# EAGLE board board2 (EAGLE 6.6.0), part 1 of 2
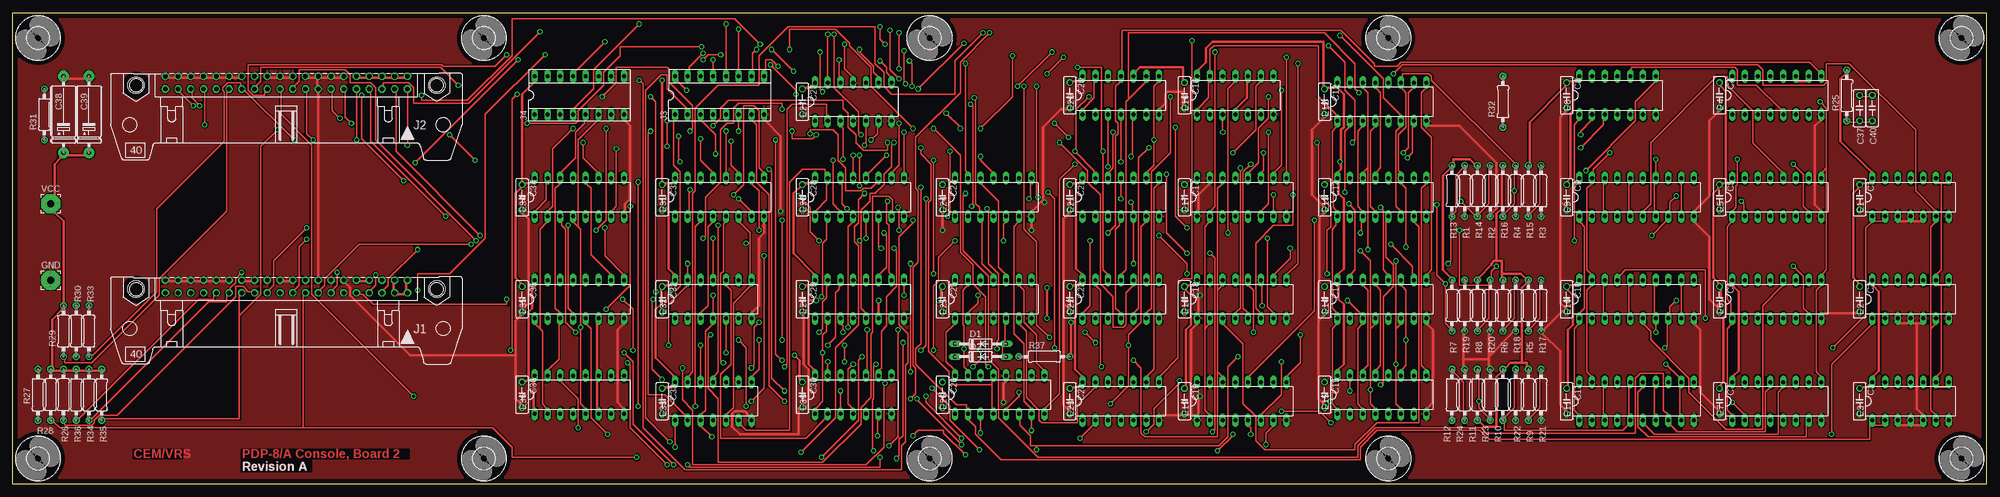
[diagram p4: board, top side]
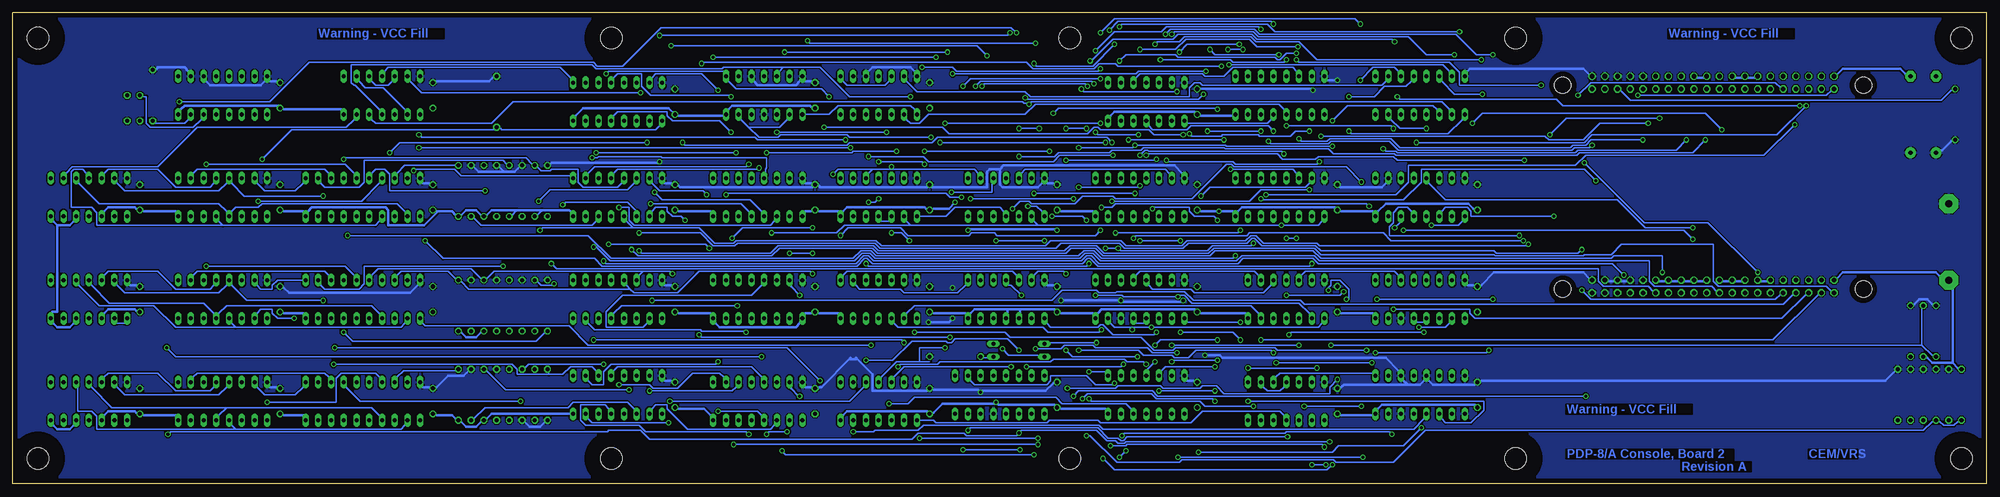
[diagram p5: board, bottom side, seen from below]

Size 393.7 x 93.98 mm. Coordinates in mm from the lower left corner, seen from the top.
Outline: 0,0 0,93.98 393.7,93.98 393.7,0 0,0
Copper layers (1*16): Top 0.035mm / dielectric 1.5mm / Bottom 0.035mm
Design rules "olimex8mil": minimum track width 10mil, minimum drill 24mil, track to track 8mil, track to pad 8mil, pad to pad 10mil, via to via 8mil, smd to smd 8mil, copper to edge 40mil, drill to drill 10mil, minimum pad ring 10mil, minimum via ring 8mil, stop-mask expansion 0mil, vias tented up to drill 0mil, thermal gap 10mil
Net classes: 1 Supply: width 0.508 mm

## Footprints (pad centres in the part's own frame; a part is rotated, then mirrored left to right if it is on the bottom)
C050-025X075 = drill 0.813 octagon: 1 -2.54,0; 2 2.54,0
E15-5 = drill 0.813 pad 2.159: + -7.62,0 | drill 0.813 pad 2.159 octagon: - 7.62,0
DO35-10 = drill 0.813 long: A 5.08,0; C -5.08,0
DIL14 = drill 0.813 long: 1 -7.62,-3.81; 2 -5.08,-3.81; 3 -2.54,-3.81; 4 0,-3.81; 5 2.54,-3.81; 6 5.08,-3.81; 7 7.62,-3.81; 8 7.62,3.81; 9 5.08,3.81; 10 2.54,3.81; 11 0,3.81; 12 -2.54,3.81; 13 -5.08,3.81; 14 -7.62,3.81
DIL16 = drill 0.813 long: 1 -8.89,-3.81; 2 -6.35,-3.81; 3 -3.81,-3.81; 4 -1.27,-3.81; 5 1.27,-3.81; 6 3.81,-3.81; 7 6.35,-3.81; 8 8.89,-3.81; 9 8.89,3.81; 10 6.35,3.81; 11 3.81,3.81; 12 1.27,3.81; 13 -1.27,3.81; 14 -3.81,3.81; 15 -6.35,3.81; 16 -8.89,3.81
DIL20 = drill 0.813 long: 1 -11.43,-3.81; 2 -8.89,-3.81; 3 -6.35,-3.81; 4 -3.81,-3.81; 5 -1.27,-3.81; 6 1.27,-3.81; 7 3.81,-3.81; 8 6.35,-3.81; 9 8.89,-3.81; 10 11.43,-3.81; 11 11.43,3.81; 12 8.89,3.81; 13 6.35,3.81; 14 3.81,3.81; 15 1.27,3.81; 16 -1.27,3.81; 17 -3.81,3.81; 18 -6.35,3.81; 19 -8.89,3.81; 20 -11.43,3.81
3,81/1,4 = drill 1.397 pad 3.81 octagon: 1 0,0
40H = drill 0.914: 1 -24.13,-1.27 | drill 0.914 octagon: 2 -24.13,1.27; 3 -21.59,-1.27; 4 -21.59,1.27; 5 -19.05,-1.27; 6 -19.05,1.27; 7 -16.51,-1.27; 8 -16.51,1.27; 9 -13.97,-1.27; 10 -13.97,1.27; 11 -11.43,-1.27; 12 -11.43,1.27; 13 -8.89,-1.27; 14 -8.89,1.27; 15 -6.35,-1.27; 16 -6.35,1.27; 17 -3.81,-1.27; 18 -3.81,1.27; 19 -1.27,-1.27; 20 -1.27,1.27; 21 1.27,-1.27; 22 1.27,1.27; 23 3.81,-1.27; 24 3.81,1.27; 25 6.35,-1.27; 26 6.35,1.27; 27 8.89,-1.27; 28 8.89,1.27; 29 11.43,-1.27; 30 11.43,1.27; 31 13.97,-1.27; 32 13.97,1.27; 33 16.51,-1.27; 34 16.51,1.27; 35 19.05,-1.27; 36 19.05,1.27; 37 21.59,-1.27; 38 21.59,1.27; 39 24.13,-1.27; 40 24.13,1.27 | hole 3.302: -29.972,0.533; 29.972,0.533
SOCKET-16 = drill 0.813 long: 1 -8.89,-3.81; 2 -6.35,-3.81; 3 -3.81,-3.81; 4 -1.27,-3.81; 5 1.27,-3.81; 6 3.81,-3.81; 7 6.35,-3.81; 8 8.89,-3.81; 9 8.89,3.81; 10 6.35,3.81; 11 3.81,3.81; 12 1.27,3.81; 13 -1.27,3.81; 14 -3.81,3.81; 15 -6.35,3.81; 16 -8.89,3.81
0207/10 = drill 0.813 octagon: 1 -5.08,0; 2 5.08,0
4,3 = hole 4.3: 0,0

## Placement (x,y rotation side)
C1  [C050-025X075]  368.3,57.15 270 top
C2  [C050-025X075]  368.3,36.83 270 top
C3  [C050-025X075]  368.3,16.51 270 top
C4  [C050-025X075]  340.36,77.47 270 top
C5  [C050-025X075]  340.36,57.15 270 top
C6  [C050-025X075]  340.36,36.83 270 top
C7  [C050-025X075]  340.36,16.51 270 top
C8  [C050-025X075]  309.88,77.47 270 top
C9  [C050-025X075]  309.88,57.15 270 top
C10  [C050-025X075]  309.88,36.83 270 top
C11  [C050-025X075]  309.88,16.51 270 top
C12  [C050-025X075]  261.62,76.2 270 top
C13  [C050-025X075]  261.62,57.15 270 top
C14  [C050-025X075]  261.62,36.83 270 top
C15  [C050-025X075]  261.62,17.78 270 top
C16  [C050-025X075]  233.68,77.47 270 top
C17  [C050-025X075]  233.68,57.15 270 top
C18  [C050-025X075]  233.68,36.83 270 top
C19  [C050-025X075]  233.68,16.51 270 top
C20  [C050-025X075]  210.82,77.47 270 top
C21  [C050-025X075]  210.82,57.15 270 top
C22  [C050-025X075]  210.82,36.83 270 top
C23  [C050-025X075]  210.82,16.51 270 top
C24  [C050-025X075]  185.42,57.15 270 top
C25  [C050-025X075]  185.42,36.83 270 top
C26  [C050-025X075]  185.42,17.78 270 top
C27  [C050-025X075]  157.48,76.2 270 top
C28  [C050-025X075]  157.48,57.15 270 top
C29  [C050-025X075]  157.48,36.83 270 top
C30  [C050-025X075]  157.48,17.78 270 top
C31  [C050-025X075]  129.54,57.15 270 top
C32  [C050-025X075]  129.54,36.83 270 top
C33  [C050-025X075]  129.54,16.51 270 top
C34  [C050-025X075]  101.6,57.15 270 top
C35  [C050-025X075]  101.6,36.83 270 top
C36  [C050-025X075]  101.6,17.78 270 top
C37  10  [C050-025X075]  368.3,74.93 90 top
C38  6.8uF  [E15-5]  10.16,73.66 90 top
C39  6.8uF  [E15-5]  15.24,73.66 90 top
C40  47  [C050-025X075]  370.84,74.93 90 top
D1  D664  [DO35-10]  193.04,27.94 0 top
D2  D664  [DO35-10]  193.04,25.4 0 top
E1  74LS95N  [DIL14]  378.46,57.15 0 top
E2  74LS95N  [DIL14]  378.46,36.83 0 top
E3  74LS95N  [DIL14]  378.46,16.51 0 top
E4  74LS123N  [DIL16]  351.79,77.47 0 top
E5  74LS175N  [DIL16]  351.79,57.15 0 top
E6  74LS175N  [DIL16]  351.79,36.83 0 top
E7  74LS175N  [DIL16]  351.79,16.51 0 top
E8  74LS00N  [DIL14]  320.04,77.47 0 top
E9  74S244N  [DIL20]  323.85,57.15 0 top
E10  74S244N  [DIL20]  323.85,36.83 0 top
E11  74S244N  [DIL20]  323.85,16.51 0 top
E12  74LS174N  [DIL16]  273.05,76.2 0 top
E13  74LS174N  [DIL16]  273.05,57.15 0 top
E14  74LS174N  [DIL16]  273.05,36.83 0 top
E15  74LS174N  [DIL16]  273.05,17.78 0 top
E16  74LS74N  [DIL14]  243.84,77.47 0 top
E17  74LS153N  [DIL16]  245.11,57.15 0 top
E18  74LS153N  [DIL16]  245.11,36.83 0 top
E19  74LS153N  [DIL16]  245.11,16.51 0 top
E20  74LS74N  [DIL14]  220.98,77.47 0 top
E21  74LS27N  [DIL14]  220.98,57.15 0 top
E22  74LS02N  [DIL14]  220.98,36.83 0 top
E23  7416N  [DIL14]  220.98,16.51 0 top
E24  74LS04N  [DIL14]  195.58,57.15 0 top
E25  74LS27N  [DIL14]  195.58,36.83 0 top
E26  74LS75N  [DIL16]  196.85,17.78 0 top
E27  7404N  [DIL14]  167.64,76.2 0 top
E28  74LS367N  [DIL16]  168.91,57.15 0 top
E29  74LS138N  [DIL16]  168.91,36.83 0 top
E30  74LS00N  [DIL14]  167.64,17.78 0 top
E31  74LS367N  [DIL16]  140.97,57.15 0 top
E32  74LS08N  [DIL14]  139.7,36.83 0 top
E33  74LS02N  [DIL14]  139.7,16.51 0 top
E34  74LS367N  [DIL16]  113.03,57.15 0 top
E35  74LS138N  [DIL16]  113.03,36.83 0 top
E36  74LS174N  [DIL16]  113.03,17.78 0 top
GND  [3,81/1,4]  7.62,40.64 0 top
J1  [40H]  54.61,39.37 180 top
J2  [40H]  54.61,80.01 180 top
J3  [SOCKET-16]  140.97,77.47 0 top
J4  [SOCKET-16]  113.03,77.47 0 top
R1  680  [0207/10]  289.56,58.42 90 top
R2  680  [0207/10]  294.64,58.42 90 top
R3  680  [0207/10]  304.8,58.42 90 top
R4  680  [0207/10]  299.72,58.42 90 top
R5  330  [0207/10]  302.26,35.56 90 top
R6  330  [0207/10]  297.18,35.56 90 top
R7  330  [0207/10]  287.02,35.56 90 top
R8  330  [0207/10]  292.1,35.56 90 top
R9  330  [0207/10]  302.26,17.78 90 top
R10  330  [0207/10]  297.18,17.78 90 top
R11  330  [0207/10]  292.1,17.78 270 top
R12  330  [0207/10]  287.02,17.78 270 top
R13  330  [0207/10]  287.02,58.42 90 top
R14  330  [0207/10]  292.1,58.42 90 top
R15  330  [0207/10]  302.26,58.42 90 top
R16  330  [0207/10]  297.18,58.42 90 top
R17  680  [0207/10]  304.8,35.56 90 top
R18  680  [0207/10]  299.72,35.56 90 top
R19  680  [0207/10]  289.56,35.56 90 top
R20  680  [0207/10]  294.64,35.56 90 top
R21  680  [0207/10]  304.8,17.78 90 top
R22  680  [0207/10]  299.72,17.78 90 top
R23  680  [0207/10]  294.64,17.78 270 top
R24  680  [0207/10]  289.56,17.78 270 top
R25  6K8  [0207/10]  365.76,77.47 270 top
R26  180  [0207/10]  10.16,17.78 90 top
R27  390  [0207/10]  5.08,17.78 270 top
R28  1K  [0207/10]  7.62,17.78 90 top
R29  180  [0207/10]  10.16,30.48 90 top
R30  390  [0207/10]  12.7,30.48 90 top
R31  1K  [0207/10]  6.35,73.66 270 top
R32  1K  [0207/10]  297.18,76.2 90 top
R33  1K  [0207/10]  15.24,30.48 90 top
R34  1K  [0207/10]  15.24,17.78 270 top
R35  1K  [0207/10]  17.78,17.78 270 top
R36  1K  [0207/10]  12.7,17.78 270 top
R37  10K  [0207/10]  205.74,25.4 0 top
U$11  [4,3]  93.98,88.9 0 top
U$12  [4,3]  5.08,88.9 0 top
U$13  [4,3]  182.88,88.9 0 top
U$14  [4,3]  274.32,88.9 0 top
U$15  [4,3]  388.62,88.9 0 top
U$16  [4,3]  388.62,5.08 0 top
U$17  [4,3]  274.32,5.08 0 top
U$18  [4,3]  182.88,5.08 0 top
U$19  [4,3]  93.98,5.08 0 top
U$20  [4,3]  5.08,5.08 0 top
VCC  [3,81/1,4]  7.62,55.88 0 top

## Tracks (layer width: path | path; a pad name or v marks a point on that pad's centre or on a via)
!ADRLTH
  Top 0.254: E14.9 282.19,41.91 282.96,42.67 282.96,69.09 280.92,71.12 280.92,77.98 281.69,78.74 E12.9
  Bottom 0.254: E8.11 319.53,82.3 318.77,83.06 284.48,83.06 282.45,81.03 E12.9
!BFSW  (via drill 0.61)
  Top 0.254: v169.16,69.6 168.66,70.1 168.66,74.17 163.83,78.99 v163.83,89.66 | v98.55,85.6 96.27,83.31 85.85,83.31 85.6,83.57 46.99,83.57 46.99,78.49 48.01,77.47 50.29,77.47 50.29,78.49 J2.24 | v177.8,70.1 E28.9
  Bottom 0.254: v177.8,70.1 177.29,69.6 v169.16,69.6 | v163.83,89.66 162.81,90.68 146.05,90.68 145.03,89.66 105.92,89.66 101.85,85.6 v98.55,85.6
!BKDTACNTL  (via drill 0.61)
  Top 0.254: v163.58,64.52 163.58,55.88 164.85,54.61 E28.3 | v133.1,64.26 132.84,64.52 v132.84,69.34 | v67.56,71.88 66.29,73.15 66.29,78.23 J2.12
  Bottom 0.254: v163.58,64.52 163.32,64.26 150.37,64.26 149.86,63.75 133.6,63.75 v133.1,64.26 | v132.84,69.34 88.14,69.34 87.38,68.58 80.52,68.58 77.22,71.88 v67.56,71.88
!BOOTF  (via drill 0.61)
  Top 0.254: v176.78,71.88 176.78,63.5 175.51,62.23 E28.10 | v210.57,69.09 v207.77,71.88
  Bottom 0.254: v207.77,71.88 v176.78,71.88 | v210.57,69.09 226.82,69.09 227.33,69.6 240.54,69.6 241.05,69.09 244.86,69.09 246.89,71.12 | 246.89,71.12 248.41,72.64 E16.6 | 246.89,71.12 240.79,71.12 239.27,72.64 E16.2
!BUSEN  (via drill 0.61)
  Top 0.254: v58.67,51.05 52.07,44.45 52.07,39.62 51.05,38.61 J1.24
  Bottom 0.254: v58.67,51.05 68.07,51.05 73.66,56.64 107.95,56.64 111.25,59.94 E34.13
!DEP  (via drill 0.61)
  Top 0.254: v92.46,48.51 72.39,68.58 72.39,78.99 71.37,80.01 67.31,80.01 67.31,81.53 66.29,82.55 57.15,82.55 57.15,80.26 56.13,79.25 J2.20 | v170.18,49.02 E28.5
  Bottom 0.254: v170.18,49.02 169.67,49.53 147.57,49.53 147.07,50.04 120.4,50.04 118.87,48.51 v92.46,48.51
!DSPLTH  (via drill 0.61)
  Top 0.254: E15.9 281.69,22.86 280.92,23.62 280.92,58.93 281.69,59.69 E13.9 | v313.69,62.48 323.6,72.39 323.6,76.2 327.41,80.01 E8.8
  Bottom 0.254: v313.69,62.48 313.44,62.74 305.56,62.74 304.29,61.47 282.45,61.47 E13.9
!EMA0  (via drill 0.61)
  Top 0.254: R34.2 15.75,12.95 39.12,36.32 42.67,36.32 42.67,37.85 J1.30 43.43,38.61 43.43,39.12 44.45,40.13 44.45,40.89 v45.72,42.16 | v165.86,87.63 165.86,82.8 167.39,81.28 E27.11 | v80.26,64.01 v100.84,84.58
  Bottom 0.254: v165.86,87.63 165.35,88.14 161.04,88.14 160.02,89.15 146.81,89.15 145.8,88.14 137.16,88.14 133.6,84.58 v100.84,84.58 | v80.26,64.01 68.33,52.07 55.63,52.07 v45.72,42.16
!EMA1  (via drill 0.61)
  Top 0.254: 45.21,33.53 45.21,37.85 J1.28 | 45.21,33.53 45.21,12.95 18.29,12.95 R35.2 | v168.91,86.61 168.91,86.11 171.7,83.31 171.7,82.04 172.47,81.28 E27.9 | v137.41,87.12 121.16,87.12 121.16,85.34 117.86,82.04 117.86,79.5 112.78,74.42 112.78,72.39 112.27,71.88 v102.62,71.88 | v52.83,70.61 49.53,67.31 49.53,37.85 45.21,33.53
  Bottom 0.254: v168.91,86.61 161.8,86.61 159.77,88.65 147.07,88.65 145.54,87.12 v137.41,87.12 | v102.62,71.88 100.58,73.91 56.13,73.91 v52.83,70.61
!EMA2  (via drill 0.61)
  Top 0.254: R36.2 13.21,12.95 37.08,36.83 40.13,36.83 40.13,37.85 J1.32 | v106.17,85.6 94.23,73.66 94.23,49.02 87.12,41.91 80.77,41.91 v80.77,38.61 | v162.56,89.66 E27.13
  Bottom 0.254: v162.56,89.66 162.05,90.17 146.3,90.17 145.29,89.15 115.32,89.15 111.76,85.6 v106.17,85.6 | v80.77,38.61 78.99,36.83 42.16,36.83 41.15,37.85 J1.32
!EMODE  (via drill 0.61)
  Top 0.254: 382.52,30.99 382.52,14.73 383.29,13.97 E3.6 | 382.52,30.99 383.29,31.75 E2.6 | 382.52,30.99 382.52,51.31 383.29,52.07 E1.6 383.29,54.61 379.48,58.42 379.48,70.61 366.27,83.82 361.7,83.82 361.7,80.01 361.19,79.5 349,79.5 349,82.55 347.98,83.57 277.11,83.57 v275.34,81.79 | v230.89,77.22 230.89,66.04 227.08,62.23 227.08,35.05 226.31,34.29 E22.6
  Bottom 0.254: v230.89,77.22 232.41,78.74 249.43,78.74 250.95,80.26 E16.8 251.97,82.3 274.83,82.3 v275.34,81.79
!FUN  (via drill 0.61)
  Top 0.254: v192.53,37.59 192.53,36.07 190.75,34.29 E25.2 | v151.13,83.57 156.21,78.49 v156.21,77.72 | v191.77,76.96 192.02,76.71 192.02,55.88 192.79,55.12 192.79,54.61 E24.3 193.29,52.07 193.29,43.94 195.33,41.91 E25.11
  Bottom 0.254: v192.53,37.59 194.56,39.62 195.07,39.62 E25.11 | v151.13,83.57 108.46,83.57 107.19,82.3 J4.15 | v156.21,77.72 157.23,76.71 191.52,76.71 v191.77,76.96
!GATEENT  (via drill 0.61)
  Top 0.254: E11.1 312.17,13.97 311.4,14.73 311.4,30.99 312.17,31.75 E10.1 312.67,34.29 313.44,35.05 313.44,51.31 312.67,52.07 E9.1 | v218.95,16 222.5,19.56 v222.5,27.69 222.5,29.72 225.04,32.26 225.04,51.31 225.81,52.07 E21.6
  Bottom 0.254: v218.95,16 215.14,16 213.87,17.27 185.67,17.27 184.4,16 171.7,16 170.69,14.99 E30.5 | v222.5,27.69 278.89,27.69 282.7,31.5 311.4,31.5 311.91,32 E10.1
!GATESR  (via drill 0.61)
  Top 0.254: E11.19 314.71,21.59 313.94,22.35 313.94,38.61 314.71,39.37 E10.19 314.71,41.91 313.94,42.67 313.94,58.93 314.71,59.69 E9.19 315.21,62.23 315.21,62.74 v318.52,66.04 | v137.67,49.02 138.18,49.53 138.18,57.15 141.22,60.2 141.22,70.61 142.49,71.88 143.76,71.88 143.76,74.93 144.78,75.95 153.42,75.95 v153.42,74.68 | v186.18,73.91 188.98,71.12 v188.98,70.87 | v193.04,70.87 199.39,77.22 v199.39,85.34 | v262.38,87.38 265.68,84.07 265.68,78.49 267.72,76.45 267.72,68.58 v267.21,68.07 | v139.7,49.02 E32.11
  Bottom 0.254: v137.67,49.02 v139.7,49.02 | v153.42,74.68 153.67,74.93 185.17,74.93 v186.18,73.91 | v188.98,70.87 v193.04,70.87 | v199.39,85.34 201.42,87.38 v262.38,87.38 | v267.21,68.07 316.48,68.07 v318.52,66.04
!IND1  (via drill 0.61)
  Top 0.254: v86.36,53.34 71.37,68.33 71.37,78.23 J2.8 | v139.19,29.72 138.68,29.21 138.68,19.05 140.72,17.02 140.72,4.32 161.54,4.32 169.16,11.94 169.16,15.24 171.2,17.27 171.2,29.97 171.45,30.23 171.45,57.4 174.75,57.4 175.51,56.64 175.51,54.61 E28.7 | v112.27,30.23 110.24,32.26 110.24,50.8 109.47,51.56 109.47,52.07 E34.3
  Bottom 0.254: v86.36,53.34 102.87,53.34 102.87,54.36 103.63,55.12 107.95,55.12 108.71,54.36 E34.3 | v139.19,29.72 138.68,30.23 v112.27,30.23
!IND2  (via drill 0.61)
  Top 0.254: v93.22,49.53 76.45,66.29 76.45,78.23 J2.4
  Bottom 0.254: v93.22,49.53 119.13,49.53 119.13,51.31 118.36,52.07 118.36,54.1 117.35,55.12 115.57,55.12 114.81,54.36 E34.5
!INIT  (via drill 0.61)
  Top 0.254: v143.76,57.66 145.8,59.69 145.8,75.44 147.83,75.44 148.84,74.42 148.84,62.99 149.61,62.23 E31.9 | v38.35,71.63 38.35,78.23 J2.34
  Bottom 0.254: v143.76,57.66 117.86,57.66 115.32,60.2 115.32,63.5 82.04,63.5 80.01,65.53 44.45,65.53 v38.35,71.63
!KEY-F  (via drill 0.61)
  Top 0.254: 195.33,19.81 195.33,20.32 E26.13 | 195.33,19.81 195.33,15.24 E26.4 | v130.56,72.39 v130.56,67.31 | v169.93,67.56 170.18,67.82 E27.5 | 195.33,19.81 186.69,19.81 186.69,22.35 182.63,26.42 182.63,56.13 183.13,56.64 183.13,63.75 181.1,65.79 v181.1,67.06
  Bottom 0.254: v130.56,72.39 127.51,75.44 110.49,75.44 109.73,74.68 J4.3 | v130.56,67.31 151.64,67.31 151.89,67.56 v169.93,67.56 170.43,67.06 v181.1,67.06
!KEYCNTL  (via drill 0.61)
  Top 0.254: v137.16,68.83 137.16,64.52 139.45,62.23 E31.13 | v68.58,68.58 J2.10
  Bottom 0.254: v137.16,68.83 136.65,68.33 131.57,68.33 131.06,68.83 118.87,68.83 117.09,67.06 83.06,67.06 82.55,67.56 80.01,67.56 78.99,68.58 v68.58,68.58
!KEYSTB  (via drill 0.61)
  Top 0.254: v242.32,50.04 242.32,78.74 243.59,80.01 E16.11 | v140.72,51.56 140.72,22.35 139.95,21.59 E33.11
  Bottom 0.254: E33.11 140.21,19.3 140.97,18.54 143.51,18.54 144.27,19.3 E33.9 | 189.23,51.56 v140.72,51.56 133.35,51.56 132.59,52.32 E31.1 | 189.23,51.56 189.99,52.32 E24.2 | 214.63,51.56 215.39,52.32 E21.2 | 214.63,51.56 189.23,51.56 | v242.32,50.04 229.36,50.04 227.84,51.56 214.63,51.56
!KFUN0  (via drill 0.61)
  Top 0.254: E3.2 372.87,11.68 371.35,11.68 E3.1 370.33,11.68 370.33,8.89 294.39,8.89 292.61,10.67 272.03,10.67 268.73,7.37 268.73,4.83 197.1,4.83 192.02,9.91 192.02,11.43 190.75,12.7 E26.2 190.25,15.24 190.25,15.75 188.21,15.75 180.09,23.88 180.09,26.92 181.1,27.94 v181.1,59.18 | v140.21,65.79 140.21,69.6 137.41,72.39 J3.3 | v168.91,59.44 v168.91,65.53
  Bottom 0.254: v140.21,65.79 140.72,66.29 167.13,66.29 167.39,66.55 167.89,66.55 v168.91,65.53 | v168.91,59.44 169.16,59.18 v181.1,59.18
!KFUN1  (via drill 0.61)
  Top 0.254: v131.06,8.38 126.24,13.21 126.24,78.49 129.29,81.53 130.56,81.53 130.56,78.74 134.37,74.93 J3.2 | v193.04,10.16 E26.3 | v362.71,9.91 362.71,23.88 370.59,31.75 E2.1
  Bottom 0.254: E2.1 371.35,32 372.87,32 E2.2 | v131.06,8.38 171.7,8.38 171.96,8.13 173.23,8.13 173.74,8.64 175.51,8.64 177.55,10.67 192.53,10.67 v193.04,10.16 193.55,9.65 203.45,9.65 203.96,10.16 213.11,10.16 214.38,8.89 266.7,8.89 268.48,10.67 274.83,10.67 275.08,10.41 362.2,10.41 v362.71,9.91
!KFUN2  (via drill 0.61)
  Top 0.254: E1.2 372.87,52.32 371.35,52.32 E1.1 370.59,52.07 369.57,51.05 369.57,33.78 v362.97,27.18 | v244.35,25.4 242.32,23.37 242.32,9.4 240.54,7.62 204.22,7.62 | 204.22,7.62 202.95,7.62 202.95,9.65 200.91,11.68 200.91,12.7 E26.6 | v131.32,38.61 132.33,38.61 133.1,39.37 133.1,62.23 131.83,63.5 131.83,72.39 J3.1 | v127.76,36.83 127.51,36.58 127.51,22.86 v129.54,20.83 | v183.39,19.05 186.94,15.49 186.94,12.7 v192.79,6.86 | 204.22,7.62 v204.22,6.86
  Bottom 0.254: v362.97,27.18 361.19,25.4 v244.35,25.4 | v131.32,38.61 131.32,39.12 130.81,39.62 130.81,40.64 129.03,40.64 127.25,38.86 127.25,36.83 v127.76,36.83 | v129.54,20.83 131.06,19.3 131.06,18.03 152.15,18.03 153.67,19.56 156.46,19.56 156.97,19.05 164.34,19.05 164.85,19.56 173.23,19.56 173.74,19.05 v183.39,19.05 | v204.22,6.86 v192.79,6.86
!LAENAB  (via drill 0.61)
  Top 0.254: v212.85,9.14 215.39,11.68 E23.2 | v189.23,9.14 182.12,16.26 v182.12,17.53 | v80.01,17.53 59.69,37.85 59.69,67.56 53.59,73.66 53.59,78.23 J2.22
  Bottom 0.254: v189.23,9.14 v212.85,9.14 | v182.12,17.53 181.1,18.54 166.37,18.54 165.35,17.53 v80.01,17.53
!MAEN  (via drill 0.61)
  Top 0.254: v235.2,88.39 235.2,40.89 233.43,40.89 232.41,39.88 232.41,25.15 228.85,21.59 E23.8 | v180.59,78.74 v189.74,87.88 | v161.54,78.23 161.04,78.74 v161.04,86.11 | v149.1,87.63 144.02,92.71 99.57,92.71 99.57,85.34 90.68,76.45 81.53,76.45 v81.53,77.47
  Bottom 0.254: v235.2,88.39 234.7,87.88 v189.74,87.88 | v180.59,78.74 180.09,78.23 v161.54,78.23 | v161.04,86.11 159.51,87.63 v149.1,87.63 | v81.53,77.47 78.99,80.01 42.16,80.01 41.15,78.99 J2.32
!MALC  (via drill 0.61)
  Top 0.254: v159,69.85 159,70.61 163.58,70.61 164.59,69.6 164.59,64.52 166.12,62.99 166.12,58.42 169.16,58.42 169.67,58.93 171.2,58.93 172.21,59.94 E28.11 | v135.13,70.36 135.64,70.87 135.64,75.44 131.06,80.01 131.06,82.55 130.56,83.06 120.4,83.06 120.4,80.01 v117.6,77.22 | v37.34,75.44 35.81,76.96 35.81,78.23 J2.36
  Bottom 0.254: v159,69.85 158.5,69.34 152.65,69.34 152.4,69.6 145.29,69.6 145.03,69.34 138.94,69.34 137.92,70.36 v135.13,70.36 | v117.6,77.22 117.09,76.71 85.85,76.71 84.58,75.44 v37.34,75.44
!MCLOCK  (via drill 0.61)
  Top 0.254: v127.25,70.36 126.75,69.85 126.75,17.78 130.05,17.78 134.11,13.72 E33.2
  Bottom 0.254: v127.25,70.36 126.75,69.85 107.44,69.85 104.65,72.64 J4.1
!MD  (via drill 0.61)
  Top 0.254: v120.4,66.8 120.4,55.37 119.63,54.61 E34.7 | v59.94,68.58 58.67,69.85 58.67,78.23 J2.18
  Bottom 0.254: v120.4,66.8 119.89,66.29 117.86,66.29 117.6,66.04 82.04,66.04 81.53,66.55 61.98,66.55 v59.94,68.58
!MEMSTART  (via drill 0.61)
  Top 0.254: v194.56,23.37 194.06,23.88 194.06,37.34 191.52,39.88 191.52,43.69 188.98,46.23 188.98,65.53 v183.64,70.87 | v179.58,70.87 171.2,79.25 171.2,83.06 166.88,87.38 166.88,87.88 164.08,90.68 154.94,90.68 v154.94,86.61 | v141.22,85.6 138.68,85.6 v137.67,84.58 | v88.9,79.5 85.34,83.06 49.53,83.06 49.53,80.26 48.51,79.25 J2.26
  Bottom 0.254: v194.56,23.37 215.9,23.37 217.93,21.34 E23.12 | v179.58,70.87 v183.64,70.87 | v154.94,86.61 153.92,85.6 v141.22,85.6 | v137.67,84.58 137.16,84.07 107.19,84.07 105.16,82.04 105.16,79.5 v88.9,79.5
!MH0  (via drill 0.61)
  Top 0.254: E21.9 226.31,62.23 227.58,63.5 v227.58,68.58 227.58,79.25 228.35,80.01 E20.8 | v312.67,69.6 312.67,70.36 314.71,72.39 E8.2
  Bottom 0.254: E8.2 315.47,74.68 319.79,78.99 323.34,78.99 324.61,80.26 E8.9 | E20.12 218.95,80.26 219.71,79.5 227.33,79.5 228.09,80.26 E20.8 | v312.67,69.6 312.17,69.09 245.62,69.09 245.11,68.58 v227.58,68.58
!MSIRDIS  (via drill 0.61)
  Top 0.254: v143.26,68.33 143.26,63.5 144.53,62.23 E31.11 | v78.74,67.56 J2.2
  Bottom 0.254: v143.26,68.33 142.75,67.82 131.32,67.82 130.81,68.33 119.13,68.33 117.35,66.55 82.8,66.55 82.3,67.06 79.25,67.06 v78.74,67.56
!PANLOCK  (via drill 0.61)
  Top 0.254: v189.99,83.82 189.99,62.48 190.25,62.23 E24.13 | v173.99,87.63 172.97,88.65 v172.97,91.19 | v105.16,90.17 90.93,75.95 80.01,75.95 80.01,78.99 78.99,80.01 73.91,80.01 73.91,79.25 J2.6
  Bottom 0.254: v189.99,83.82 189.48,83.31 178.31,83.31 v173.99,87.63 | v172.97,91.19 172.47,91.69 143.51,91.69 141.99,90.17 v105.16,90.17 | R31.1 7.11,78.49 9.14,76.45 71.12,76.45 73.15,78.49 J2.6
!PULSELOADADD  (via drill 0.61)
  Top 0.254: v144.78,56.9 147.07,54.61 E31.7 | v77.98,60.45 69.6,68.83 v69.6,77.47
  Bottom 0.254: v144.78,56.9 144.53,56.64 116.33,56.64 112.78,60.2 112.78,62.74 80.26,62.74 v77.98,60.45 | v69.6,77.47 32,77.47 30.99,78.49 J2.40
!RUN  (via drill 0.61)
  Top 0.254: 57.91,11.18 9.4,11.18 8.13,12.45 R28.1 | 57.91,11.18 57.91,37.85 J1.18 | v197.61,48.51 197.61,51.82 197.87,52.07 E24.5 | v187.96,48.51 184.66,45.21 184.66,40.39 183.64,39.37 v183.64,26.67 | v169.42,25.4 168.66,24.64 168.66,12.7 v161.29,5.33 | v124.46,5.33 99.57,5.33 99.57,7.37 95.76,11.18 57.91,11.18
  Bottom 0.254: v187.96,48.51 v197.61,48.51 | v183.64,26.67 182.37,25.4 v169.42,25.4 | v124.46,5.33 v161.29,5.33
!SHLT
  Bottom 0.254: J3.5 142.75,72.64 143.51,71.88 159.51,71.88 E27.1
!SINGSTEP  (via drill 0.61)
  Top 0.254: v87.12,69.6 v92.2,64.52 | v65.28,72.9 63.75,74.42 63.75,78.23 J2.14 | v167.64,65.53 E28.13
  Bottom 0.254: v167.64,65.53 167.39,65.79 141.48,65.79 140.46,64.77 133.86,64.77 133.35,65.28 118.36,65.28 117.6,64.52 v92.2,64.52 | v87.12,69.6 83.82,72.9 v65.28,72.9
!SRDATA  (via drill 0.61)
  Top 0.254: v130.81,27.69 130.81,35.81 134.37,39.37 E32.13 v134.62,43.94 | v311.4,48.51 311.4,71.63 312.17,72.39 E8.1 | J2.30 42.93,78.23 42.67,77.98 42.67,54.36 29.21,40.89 29.21,37.59 15.75,24.13 10.41,24.13 10.41,24.64 R29.1
  Bottom 0.254: v130.81,27.69 12.95,27.69 | 12.95,27.69 10.92,25.65 R29.1 | v311.4,48.51 307.85,44.96 277.62,44.96 276.1,43.43 225.3,43.43 223.77,44.96 223.27,44.96 222.25,43.94 180.34,43.94 179.32,44.96 178.82,44.96 177.29,43.43 135.13,43.43 v134.62,43.94 | 12.95,27.69 12.95,34.8 R30.2
!STATE  (via drill 0.61)
  Top 0.254: v113.79,68.07 113.79,65.02 116.59,62.23 E34.11 | v36.07,75.44 33.27,78.23 J2.38
  Bottom 0.254: v113.79,68.07 80.26,68.07 78.74,69.6 41.91,69.6 v36.07,75.44
!STHIS
  Bottom 0.254: J3.4 140.21,74.68 141.22,75.69 189.74,75.69 191.77,73.66 211.07,73.66 212.85,71.88 214.63,71.88 215.39,72.64 E20.2
!TS1  (via drill 0.61)
  Top 0.254: v218.44,63.25 E20.3 | J1.26 47.75,38.35 46.99,38.35 45.97,39.37 44.45,39.37 44.45,37.34 20.83,13.72 17.27,13.72 16.26,12.7 16.26,12.19 15.75,11.68 10.41,11.68 10.41,11.94 R26.1 | v179.58,9.65 180.59,10.67 185.67,10.67 185.67,10.16 v189.99,5.84 | v240.28,6.6 243.33,9.65 v243.33,9.91 | v239.27,10.41 239.78,10.92 239.78,44.96 v238.76,45.97 | v234.19,45.97 230.12,50.04 v230.12,61.72
  Bottom 0.254: 218.44,62.74 222.25,62.74 | 218.44,62.74 201.93,62.74 201.17,61.98 E24.9 | 222.25,62.74 223.01,61.98 E21.10 | 218.44,62.74 v218.44,63.25 | R27.2 5.84,12.45 6.6,11.68 8.64,11.68 9.4,12.45 R26.1 10.92,12.45 12.7,10.67 112.01,10.67 118.36,4.32 129.79,4.32 130.3,4.83 160.53,4.83 161.04,4.32 173.48,4.32 178.82,9.65 v179.58,9.65 | v189.99,5.84 239.52,5.84 v240.28,6.6 | v243.33,9.91 242.82,10.41 v239.27,10.41 | v234.19,45.97 v238.76,45.97 | v230.12,61.72 229.11,62.74 222.25,62.74
ADDR0  (via drill 0.61)
  Top 0.254: v256.29,83.82 256.29,43.94 254.25,41.91 E18.9 | v152.65,83.31 151.38,84.58 150.11,84.58 150.11,82.55 J3.9
  Bottom 0.254: v256.29,83.82 256.03,84.07 191.52,84.07 190.25,82.8 178.05,82.8 177.04,83.82 173.74,83.82 173.23,83.31 v152.65,83.31
ADDR1  (via drill 0.61)
  Top 0.254: v204.47,57.15 204.22,57.4 v204.22,79.25 | v176.78,80.77 175.01,82.55 v175.01,90.42 | v251.46,57.66 E17.7 | v142.24,91.69 J3.12
  Bottom 0.254: v251.46,57.66 251.21,57.91 207.52,57.91 206.76,57.15 v204.47,57.15 | v204.22,79.25 202.69,80.77 v176.78,80.77 | v175.01,90.42 173.23,92.2 142.75,92.2 v142.24,91.69
ADDR2  (via drill 0.61)
  Top 0.254: v206.25,81.79 v209.55,85.09 | v155.7,82.3 v151.38,86.61 | v148.34,86.61 147.57,85.85 147.57,82.55 J3.10 | v254,85.09 E17.9
  Bottom 0.254: v209.55,85.09 v254,85.09 | v206.25,81.79 169.67,81.79 169.16,82.3 v155.7,82.3 | v151.38,86.61 v148.34,86.61
BEMA0
  Bottom 0.254: E27.10 169.67,81.03 168.91,81.79 156.46,81.79 155.96,81.28 152.15,81.28 150.37,83.06 138.43,83.06 137.67,82.3 J3.14
BEMA1  (via drill 0.61)
  Top 0.254: v172.97,84.33 174.24,83.06 174.24,82.04 175.01,81.28 E27.8 | v137.67,85.85 134.87,83.06 134.87,82.55 J3.15
  Bottom 0.254: v172.97,84.33 171.7,85.6 161.8,85.6 161.29,85.09 141.99,85.09 141.48,84.58 140.97,84.58 139.7,85.85 v137.67,85.85
BEMA2  (via drill 0.61)
  Top 0.254: v164.85,84.58 164.85,81.28 E27.12 | J3.13 v139.7,84.58
  Bottom 0.254: v139.7,84.58 140.21,84.07 150.37,84.07 150.88,84.58 v164.85,84.58
BPOK  (via drill 0.61)
  Top 0.254: E16.1 236.47,74.93 238.51,76.96 238.51,80.01 E16.13 238.76,86.61 239.52,87.38 260.35,87.38 260.35,77.22 263.91,73.66 E12.1 263.91,71.12 263.14,70.36 263.14,59.69 263.4,59.44 263.4,55.12 263.91,54.61 E13.1 263.91,52.07 263.91,51.56 263.14,50.8 263.14,35.05 263.91,34.29 E14.1 263.91,31.75 263.14,30.99 263.14,16.51 | E20.1 213.61,74.93 215.65,76.96 215.65,80.01 E20.13 | 263.14,16.51 263.14,16 263.91,15.24 E15.1 | 263.14,16.51 v262.64,16.51 | E7.1 342.65,13.97 341.88,14.73 341.88,30.99 342.65,31.75 E6.1 342.65,34.29 342.65,36.07 341.88,36.83 341.88,51.31 342.65,52.07 E5.1 343.15,54.61 343.66,55.12 343.66,59.44 343.92,59.69 v343.92,64.77
  Bottom 0.254: J4.10 119.89,80.26 120.65,79.5 156.46,79.5 156.97,80.01 157.99,80.01 159,78.99 159,77.22 190.75,77.22 191.77,78.23 213.36,78.23 215.39,80.26 E20.13 | E16.1 230.89,73.66 229.11,75.44 214.63,75.44 213.87,74.68 E20.1 | v262.64,16.51 226.82,16.51 224.03,19.3 E23.10 | E12.1 264.67,71.37 265.43,70.61 296.16,70.61 296.42,70.87 R32.1 297.69,70.61 338.07,70.61 v343.92,64.77
BRUN  (via drill 0.61)
  Top 0.254: E24.6 200.41,52.07 199.64,51.31 199.64,29.97 201.68,27.94 201.68,16.51 202.95,15.24 E26.7 v203.2,10.67 | v127.25,77.22 128.27,76.2 v128.27,38.35 | v139.7,37.59 E32.4 139.45,31.75 138.18,30.48 138.18,14.73 137.41,13.97 E33.3 137.41,11.43 v139.45,9.4
  Bottom 0.254: v127.25,77.22 122.17,77.22 120.14,79.25 115.82,79.25 114.81,80.26 J4.12 | v128.27,38.35 129.03,37.59 v139.7,37.59 | v203.2,10.67 202.69,11.18 177.29,11.18 175.26,9.14 173.23,9.14 172.72,8.64 172.21,8.64 171.45,9.4 v139.45,9.4
BUS0  (via drill 0.61)
  Top 0.254: E11.3 317.25,13.97 317.25,19.05 E11.18 | R9.1 302.51,13.21 304.55,15.24 304.55,22.35 R21.2 | E15.3 268.99,15.24 268.22,16 268.22,30.99 268.99,31.75 E14.3 268.73,34.04 v266.19,36.58
  Bottom 0.254: E11.18 316.99,21.34 315.72,22.61 305.31,22.61 R21.2 | v266.19,36.58 186.44,36.58 184.4,38.61 177.55,38.61 177.04,38.1 173.74,38.1 173.48,38.35 160.02,38.35 158.24,36.58 136.91,36.58 136.14,35.81 40.64,35.81 38.61,37.85 J1.34 | R9.1 301.75,12.95 299.47,15.24 282.96,15.24 281.94,16.26 271.02,16.26 269.75,14.99 E15.3
BUS1  (via drill 0.61)
  Top 0.254: E10.3 317.25,34.29 317.25,39.37 E10.18 | R5.1 302.51,30.99 304.55,33.02 304.55,40.13 R17.2 | E15.13 272.03,22.86 272.8,23.62 272.8,38.61 272.03,39.37 E14.13 | v118.36,34.8 123.19,39.62 v123.19,55.37 | v176.53,55.12 176.78,54.86 v176.78,50.55 | v228.6,49.53 234.19,43.94 v234.19,41.91
  Bottom 0.254: E10.18 316.99,41.66 316.23,42.42 306.83,42.42 305.31,40.89 R17.2 304.29,40.39 302.77,38.86 270.51,38.86 | v118.36,34.8 103.12,34.8 103.12,34.04 102.11,33.02 40.89,33.02 36.07,37.85 J1.36 | v123.19,55.37 123.7,55.88 173.74,55.88 174.5,55.12 v176.53,55.12 | v176.78,50.55 177.8,49.53 197.36,49.53 197.87,50.04 202.44,50.04 202.95,49.53 215.14,49.53 216.66,51.05 227.08,51.05 v228.6,49.53 | v234.19,41.91 234.7,42.42 256.79,42.42 261.11,38.1 269.75,38.1 270.51,38.86 | 270.51,38.86 271.27,39.62 E14.13
BUS2  (via drill 0.61)
  Top 0.254: E9.3 317.25,54.61 317.25,59.69 E9.18 | R15.1 302.51,53.85 304.55,55.88 304.55,62.99 R3.2 | E13.6 276.61,54.61 275.84,55.37 275.84,70.36 276.61,71.12 E12.6 276.61,73.66 273.3,76.96 273.3,80.77 v264.67,89.41 | v144.78,28.7 146.3,27.18 v146.3,15.49 | v179.07,17.02 180.09,18.03 180.09,23.11 179.58,23.62 179.58,43.18 180.59,44.2 180.59,58.42 180.09,58.93 180.09,69.09 188.98,77.98 188.98,84.07 v194.82,89.92
  Bottom 0.254: E9.18 316.99,61.98 315.47,63.5 R3.2 | v144.78,28.7 42.67,28.7 33.53,37.85 J1.38 | v146.3,15.49 155.96,15.49 156.97,16.51 178.56,16.51 v179.07,17.02 | v194.82,89.92 195.33,89.41 v264.67,89.41 | R15.1 301.75,53.09 300.23,51.56 278.13,51.56 277.37,52.32 E13.6
BUS3  (via drill 0.61)
  Top 0.254: E11.16 322.33,19.05 322.33,13.97 E11.5 322.07,11.68 321.06,10.67 297.43,10.67 297.43,12.19 R10.1 297.43,13.21 299.47,15.24 299.47,22.35 R22.2 | 270.76,30.99 v270.76,18.8 270.76,16 271.53,15.24 E15.4 | 270.76,30.99 271.53,31.75 E14.4 | v268.73,46.48 270.76,44.45 270.76,30.99
  Bottom 0.254: v268.73,46.48 268.22,45.97 242.57,45.97 241.05,47.5 222,47.5 220.98,46.48 183.9,46.48 182.88,47.5 177.55,47.5 176.02,45.97 155.19,45.97 154.18,46.99 134.11,46.99 132.84,45.72 98.3,45.72 98.04,45.47 80.52,45.47 80.26,45.72 74.93,45.72 72.9,47.75 54.61,47.75 54.61,40.39 53.59,39.37 32,39.37 30.99,38.35 J1.40 | v270.76,18.8 295.4,18.8 299.21,22.61 R22.2
BUS4  (via drill 0.61)
  Top 0.254: E10.5 322.33,34.29 322.33,39.37 E10.16 | R6.1 297.43,30.99 299.47,33.02 299.47,40.13 R18.2 | E15.14 269.49,22.86 270.26,23.62 270.26,38.61 269.49,39.37 E14.14 | v58.67,48.77 57.15,47.24 57.15,39.62 56.13,38.61 J1.20 | v116.33,50.55 118.36,52.58 v118.36,70.87 | v139.7,71.37 141.22,72.9 141.22,74.93 142.75,76.45 165.61,76.45 165.61,74.93 166.62,73.91 166.62,71.12 168.15,69.6 168.15,68.07 169.67,66.55 174.5,66.55 v174.5,68.07 | v260.1,68.07 260.35,67.82 260.35,57.66 262.89,55.12 262.89,51.31 262.13,50.55 v262.13,41.91
  Bottom 0.254: E10.16 322.07,41.66 320.8,42.93 302.26,42.93 300.23,40.89 R18.2 299.21,40.89 297.69,42.42 267.97,42.42 | v58.67,48.77 60.45,50.55 v116.33,50.55 | v118.36,70.87 118.87,71.37 v139.7,71.37 | v174.5,68.07 175.51,69.09 209.3,69.09 210.31,68.07 226.82,68.07 227.33,67.56 259.59,67.56 v260.1,68.07 | v262.13,41.91 262.64,42.42 267.97,42.42 | 267.97,42.42 268.73,41.66 E14.14
BUS5  (via drill 0.61)
  Top 0.254: E9.5 322.33,54.61 322.33,59.69 E9.16 | R16.1 297.43,53.85 299.47,55.88 v299.47,58.42 299.47,62.99 R4.2 299.47,64.01 282.96,80.52 282.96,81.28 282.45,81.79 277.11,81.79 277.11,81.28 E12.11 277.11,78.74 277.88,77.98 277.88,71.12 276.35,69.6 276.35,62.48 276.61,62.23 E13.11 277.11,59.69 277.88,58.93 v277.88,47.24
  Bottom 0.254: v299.47,58.42 318.52,58.42 318.52,61.72 319.53,62.74 321.31,62.74 322.07,61.98 E9.16 | v277.88,47.24 277.37,47.24 274.57,44.45 225.81,44.45 224.28,45.97 222.76,45.97 221.74,44.96 180.85,44.96 179.83,45.97 178.31,45.97 176.78,44.45 149.61,44.45 148.59,45.47 134.11,45.47 133.1,44.45 67.31,44.45 67.31,40.39 66.29,39.37 54.86,39.37 53.85,38.35 J1.22
BUS6  (via drill 0.61)
  Top 0.254: E11.7 327.41,13.97 327.41,19.05 E11.14 | R23.2 294.39,13.21 292.35,15.24 v292.35,16.51 292.35,22.35 R11.1 | 275.84,30.99 v275.84,23.88 275.84,16 276.61,15.24 E15.6 | 275.84,30.99 276.61,31.75 E14.6 | v72.39,41.66 72.39,39.62 71.37,38.61 J1.8 | v275.84,44.45 275.84,30.99
  Bottom 0.254: v292.35,16.51 324.36,16.51 327.15,19.3 E11.14 | v72.39,41.66 74.68,43.94 133.35,43.94 134.37,44.96 148.34,44.96 149.35,43.94 177.04,43.94 178.56,45.47 179.58,45.47 180.59,44.45 222,44.45 223.01,45.47 224.03,45.47 225.55,43.94 275.34,43.94 v275.84,44.45 | v275.84,23.88 290.83,23.88 291.59,23.11 R11.1
BUS7  (via drill 0.61)
  Top 0.254: E10.14 327.41,39.37 327.41,34.29 E10.7 v327.66,30.23 | R7.1 286.77,30.99 285.75,32 v285.75,39.88 283.97,41.66 v283.97,55.63 | E12.3 268.99,71.12 268.22,70.36 268.22,55.37 268.99,54.61 E13.3 268.99,52.07 268.99,50.29 v268.73,50.04 | v80.77,46.74 74.93,40.89 74.93,39.62 73.91,38.61 J1.6
  Bottom 0.254: v285.75,39.88 286,39.62 288.29,39.62 289.05,40.39 R19.2 | v327.66,30.23 325.88,28.45 289.31,28.45 287.53,30.23 R7.1 | v80.77,46.74 81.53,45.97 97.79,45.97 98.3,46.48 132.84,46.48 133.86,47.5 144.53,47.5 146.05,49.02 146.56,49.02 147.57,48.01 159.26,48.01 160.27,46.99 171.96,46.99 172.97,48.01 184.66,48.01 185.67,46.99 220.73,46.99 221.74,48.01 249.17,48.01 249.68,47.5 254,47.5 256.54,50.04 v268.73,50.04 | v283.97,55.63 283.46,56.13 271.02,56.13 269.49,54.61 E13.3
BUS8  (via drill 0.61)
  Top 0.254: E13.13 272.03,62.23 272.8,62.99 272.8,77.98 272.03,78.74 E12.13 | E9.7 327.41,54.61 327.41,59.69 E9.14 v327.66,64.77 | R1.2 289.31,62.99 287.78,61.47 287.78,54.36 287.27,53.85 R13.1 286.77,52.83 286.77,44.45 v286.26,43.94
  Bottom 0.254: v286.26,43.94 285.24,42.93 77.47,42.93 77.47,40.39 76.45,39.37 67.56,39.37 66.55,38.35 J1.12 | v327.66,64.77 327.41,65.02 291.34,65.02 290.07,63.75 R1.2 289.05,63.25 288.29,62.48 286.51,62.48 286.26,62.74 280.92,62.74 280.92,60.2 279.91,59.18 273.05,59.18 272.29,59.94 E13.13
BUS9  (via drill 0.61)
  Top 0.254: E11.9 332.49,13.97 332.49,19.05 E11.12 332.23,21.34 v329.69,23.88 | E14.11 277.11,39.37 277.88,38.61 v277.88,28.7 277.88,23.62 277.11,22.86 E15.11 | v98.55,36.83 98.55,35.81 71.88,35.81 69.85,37.85 69.09,37.85 J1.10 | v121.67,36.83 123.7,34.8 v123.7,26.67 | v215.9,28.19 v213.87,30.23 | R12.1 287.27,22.35 289.31,20.32 289.31,13.21 R24.2
  Bottom 0.254: v329.69,23.88 294.13,23.88 293.12,22.86 293.12,21.84 286.77,21.84 | 286.77,21.84 283.97,21.84 282.45,23.37 278.13,23.37 277.37,22.61 E15.11 | v121.67,36.83 v98.55,36.83 | v123.7,26.67 141.48,26.67 141.99,27.18 161.8,27.18 162.31,26.67 166.12,26.67 168.66,29.21 194.82,29.21 195.83,30.23 v213.87,30.23 | v215.9,28.19 216.41,28.7 v277.88,28.7 | 286.77,21.84 286.77,22.35 R12.1
BUS10  (via drill 0.61)
  Top 0.254: E10.12 E10.9 | 294.39,39.62 294.39,40.13 R20.2 294.89,41.15 294.89,42.42 v295.91,43.43 | 294.39,39.62 294.39,33.02 292.35,30.99 R8.1 | E13.4 271.53,54.61 270.76,55.37 270.76,70.36 271.53,71.12 E12.4 | v91.44,47.75 69.09,47.75 62.23,40.89 62.23,39.62 61.21,38.61 J1.16 | 294.39,39.62 288.54,39.62 v288.54,50.55
  Bottom 0.254: v295.91,43.43 323.6,43.43 323.6,39.88 324.61,38.86 331.47,38.86 332.23,39.62 E10.12 | v91.44,47.75 91.69,47.5 133.1,47.5 133.6,48.01 144.27,48.01 145.8,49.53 146.81,49.53 147.83,48.51 159.51,48.51 160.53,47.5 171.7,47.5 172.72,48.51 186.69,48.51 187.71,47.5 220.47,47.5 221.49,48.51 249.43,48.51 249.94,48.01 253.75,48.01 256.79,51.05 270,51.05 | 270,51.05 271.27,52.32 E13.4 | v288.54,50.55 288.04,51.05 270,51.05
BUS11  (via drill 0.61)
  Top 0.254: E9.12 E9.9 | R2.2 294.39,62.99 294.39,55.88 292.35,53.85 R14.1 291.59,53.59 v288.8,56.39 | 270.26,62.99 269.49,62.23 E13.14 | 270.26,62.99 270.26,77.98 269.49,78.74 E12.14 | v64.77,42.16 64.77,39.62 63.75,38.61 J1.14 | v270.26,46.74 270.26,62.99
  Bottom 0.254: E9.12 332.23,59.94 331.47,59.18 324.61,59.18 323.6,60.2 323.6,64.52 295.91,64.52 295.15,63.75 R2.2 | v64.77,42.16 64.77,45.47 74.42,45.47 74.93,44.96 132.84,44.96 134.37,46.48 153.92,46.48 154.94,45.47 176.28,45.47 177.8,46.99 182.63,46.99 183.64,45.97 221.23,45.97 222.25,46.99 240.79,46.99 242.32,45.47 268.99,45.47 v270.26,46.74 | v288.8,56.39 286.51,58.67 271.02,58.67 269.75,59.94 E13.14
DISP0
  Top 0.254: E36.15 106.93,22.86 108.97,24.89 108.97,31.75 E35.3 108.97,34.29 108.2,35.05 108.2,58.93 108.97,59.69 E34.14 109.47,62.23 112.27,65.02 112.27,70.1 114.05,71.88 114.05,72.39 J4.5
DISP1  (via drill 0.61)
  Top 0.254: 112.78,51.31 112.01,52.07 E34.4 | 112.78,51.31 113.28,50.8 v113.28,31.24 113.28,16 114.05,15.24 E36.5 | 112.78,51.31 112.78,68.58 116.59,72.39 J4.6
  Bottom 0.254: v113.28,31.24 107.95,31.24 107.19,32 E35.2
DISP2  (via drill 0.61)
  Top 0.254: 105.16,30.99 105.66,30.48 105.66,16 106.43,15.24 E36.2 | 105.16,30.99 104.39,31.75 E35.1 | 105.16,30.99 105.16,50.8 106.43,52.07 E34.2 106.93,54.61 107.7,55.37 107.7,66.8 v111.76,70.87
  Bottom 0.254: v111.76,70.87 117.09,70.87 118.87,72.64 J4.7
DISPINH  (via drill 0.61)
  Top 0.254: v243.33,66.04 247.9,70.61 247.9,79.25 248.67,80.01 E16.9 | E22.12 218.19,41.91 217.42,42.67 v217.42,66.29 217.17,66.55 217.17,83.06 v212.34,83.06 | v124.97,91.69 115.82,82.55 115.82,78.74 112.01,74.93 J4.4 | v176.78,82.8 v176.78,89.92
  Bottom 0.254: v217.42,66.29 226.06,66.29 226.31,66.04 v243.33,66.04 | v124.97,91.69 125.98,92.71 173.99,92.71 v176.78,89.92 | v176.78,82.8 177.29,82.3 205.49,82.3 206.25,83.06 v212.34,83.06
DISPLAY0  (via drill 0.61)
  Top 0.254: v249.94,7.87 249.94,10.16 251.21,11.43 E19.7 | v189.23,7.87 180.34,16.76 v180.34,17.02 | v153.92,16.51 150.88,19.56 150.88,57.66 148.34,60.2 148.34,71.63 147.57,72.39 J3.7
  Bottom 0.254: v249.94,7.87 v189.23,7.87 | v180.34,17.02 179.32,18.03 166.62,18.03 165.61,17.02 154.43,17.02 v153.92,16.51
DISPLAY1  (via drill 0.61)
  Top 0.254: v256.79,29.72 256.79,24.13 254.25,21.59 E19.9 | v206.76,29.21 204.22,31.75 204.22,48.26 201.68,50.8 v201.68,79.25 | v178.05,79.76 177.8,80.01 v177.8,86.36 | v144.78,90.68 J3.11
  Bottom 0.254: v256.79,29.72 256.29,29.21 v206.76,29.21 | v201.68,79.25 200.66,80.26 178.56,80.26 v178.05,79.76 | v177.8,86.36 173.99,90.17 164.59,90.17 163.58,91.19 145.29,91.19 v144.78,90.68
DISPLAY2  (via drill 0.61)
  Top 0.254: v250.19,49.02 250.19,35.31 251.21,34.29 E18.7 | v234.19,51.05 231.9,53.34 v231.9,71.12 | v160.27,69.6 159.51,68.83 155.45,68.83 v155.45,70.36 | v144.78,70.36 J3.6
  Bottom 0.254: v250.19,49.02 248.16,51.05 v234.19,51.05 | v231.9,71.12 208.28,71.12 207.01,69.85 179.32,69.85 178.05,71.12 177.29,71.12 176.78,70.61 167.13,70.61 166.12,69.6 v160.27,69.6 | v155.45,70.36 v144.78,70.36
E30PIN8  (via drill 0.61)
  Top 0.254: v179.07,43.94 v179.07,22.35 | v223.52,43.94 E21.5 223.27,54.61 223.27,55.88 v223.01,56.13 | v220.98,56.9 E21.11
  Bottom 0.254: v179.07,22.35 175.77,22.35 E30.8 | v179.07,43.94 179.58,43.43 223.01,43.43 v223.52,43.94 | v220.98,56.9 221.74,56.13 v223.01,56.13
E35-Y4
  Bottom 0.254: E35.11 117.35,41.66 118.11,42.42 135.89,42.42 136.65,41.66 E32.12
ENT0  (via drill 0.61)
  Top 0.254: E7.13 350.27,19.05 349.5,18.29 349.5,10.41 331.98,10.41 330.71,11.68 E11.8 329.95,13.97 329.18,14.73 329.18,22.1 324.61,22.1 323.6,21.08 323.6,10.16 293.88,10.16 292.86,11.18 271.78,11.18 268.22,7.62 268.22,5.33 204.47,5.33 196.6,13.21 196.6,22.86 194.56,24.89 194.56,41.4 189.48,46.48 189.48,57.4 v189.99,57.91 | v112.78,11.18 112.78,17.02 109.47,20.32 E36.14 | v157.23,6.35 164.08,13.21 164.08,27.18 168.66,31.75 168.66,47.5 167.89,48.26 167.89,51.31 168.66,52.07 168.66,56.64 v169.93,57.91
  Bottom 0.254: E3.13 372.87,19.3 371.35,17.78 352.55,17.78 351.03,19.3 E7.13 | v112.78,11.18 116.33,7.62 129.29,7.62 130.56,6.35 v157.23,6.35 | v189.99,57.91 v169.93,57.91
ENT1  (via drill 0.61)
  Top 0.254: v226.06,10.41 227.58,11.94 227.58,14.99 232.66,20.07 v232.66,20.57 | v329.44,27.18 329.95,27.69 329.95,31.75 E10.8 330.45,34.29 330.45,35.31 v331.72,36.58
  Bottom 0.254: E2.13 372.87,39.62 371.35,38.1 352.55,38.1 351.03,39.62 E6.13 350.01,39.62 346.96,36.58 v331.72,36.58 | v226.06,10.41 222,10.41 221.74,10.67 213.11,10.67 212.09,11.68 177.04,11.68 176.28,10.92 114.3,10.92 112.27,12.95 E36.4 | v232.66,20.57 239.27,27.18 v329.44,27.18
ENT2  (via drill 0.61)
  Top 0.254: v147.32,16.51 149.86,19.05 v149.86,45.47 | v326.9,49.53 329.69,52.32 E9.8 330.45,54.61 330.45,56.13 v331.72,57.4
  Bottom 0.254: E1.13 372.87,59.94 371.35,58.42 352.55,58.42 351.03,59.94 E5.13 350.01,59.94 347.47,57.4 v331.72,57.4 | v147.32,16.51 100.33,16.51 100.33,14.73 102.87,12.19 107.95,12.19 108.71,12.95 E36.3 | v149.86,45.47 150.37,44.96 176.53,44.96 178.05,46.48 180.09,46.48 181.1,45.47 221.49,45.47 222.5,46.48 224.54,46.48 226.06,44.96 274.32,44.96 278.89,49.53 v326.9,49.53
GND  (via drill 0.61)
  Top 0.508: C7.2 340.11,14.73 336.55,18.29 336.55,30.73 335.53,31.75 E10.10 | C6.2 340.11,35.05 338.33,36.83 338.33,49.28 335.53,52.07 E9.10 335.53,54.61 338.33,57.4 338.33,72.39 340.11,74.17 C4.2 | E1.3 376.43,52.32 377.95,52.32 E1.4 378.97,52.32 380.49,52.32 E1.5 | E3.3 376.43,11.68 377.95,11.68 E3.4 378.97,11.68 380.49,11.68 E3.5 380.75,13.97 379.73,14.99 379.73,32 | E6.8 361.19,34.04 367.54,34.04 C2.2 | E2.3 376.43,32 377.95,32 E2.4 378.97,32 379.73,32 | 379.73,32 380.49,32 E2.5 | E4.8 360.43,72.39 359.41,71.37 359.41,55.63 360.43,54.61 E5.8 | 289.31,24.89 289.31,29.97 R19.1 | 289.31,24.89 289.31,23.37 R24.1 | 294.39,25.4 294.39,29.97 R20.1 | 294.39,25.4 294.39,24.89 | 294.39,24.89 294.39,23.37 R23.1 | 294.39,25.4 299.21,30.23 R18.1 | 294.39,24.89 289.31,24.89 | E14.8 282.19,31.75 283.21,30.73 283.21,16.26 282.19,15.24 E15.8 | C11.2 309.63,14.73 308.61,15.75 308.61,26.42 305.05,29.97 R17.1 305.31,30.73 309.12,34.54 C10.2 309.63,35.05 308.61,36.07 308.61,56.13 308.74,56.26 | 308.74,56.26 309.63,55.37 C9.2 | 308.74,56.26 308.61,56.39 308.61,73.15 309.63,74.17 C8.2 | E20.7 228.85,74.93 229.87,75.95 229.87,77.72 230.38,78.23 233.43,78.23 233.43,75.69 C16.2 | C12.2 261.37,72.9 259.08,70.61 259.08,57.66 261.37,55.37 C13.2 261.37,53.85 260.6,53.09 260.6,40.13 260.35,39.88 260.35,32.77 260.48,32.64 | v236.73,37.59 236.47,37.34 236.47,34.29 E18.1 235.97,31.75 234.95,30.73 234.95,13.72 | 260.48,32.64 261.37,33.53 C14.2 | 260.48,32.64 260.35,32.51 260.35,17.02 261.37,16 C15.2 | E23.7 229.11,13.72 232.92,13.72 C19.2 234.44,13.72 234.95,13.72 | 234.95,13.72 235.71,13.72 E19.1 236.47,13.97 236.47,17.27 v236.73,17.53
  Top 0.508: v197.61,16.26 197.61,20.07 197.87,20.32 E26.12 | R2.1 294.89,53.85 295.91,54.86 295.91,64.01 288.54,71.37 282.45,71.37 E12.8 | 205.36,56.52 205.49,56.64 205.49,71.12 209.04,74.68 210.06,74.68 C20.2 | 205.36,56.52 203.45,54.61 E24.7 v203.2,50.55 | v185.42,50.55 C24.2 | E17.15 238.51,59.69 236.47,57.66 236.47,54.61 E17.1 | E33.7 146.81,13.72 146.05,14.48 144.02,14.48 143.51,13.97 143.51,11.43 145.03,9.91 156.72,9.91 156.72,14.99 C30.2 157.73,16 158.75,17.02 158.75,22.86 157.73,23.88 157.73,33.53 C29.2 | 209.68,35.94 210.57,35.05 C22.2 | 209.68,35.94 209.55,36.07 209.55,52.83 210.57,53.85 C21.2 | v205.74,56.13 205.36,56.52 | C38.- 11.18,80.77 14.22,80.77 C39.- | J2.15 60.71,80.77 60.71,79.25 J2.16 J1.15 | J2.15 61.47,81.03 62.99,81.03 J2.13 64.01,81.03 65.53,81.03 J2.11 | J2.39 30.99,81.03 32.51,81.03 J2.37 33.53,81.03 35.05,81.03 J2.35 36.07,81.03 37.59,81.03 J2.33 38.61,81.03 40.13,81.03 J2.31 41.15,81.03 42.67,81.03 J2.29 43.69,81.03 45.21,81.03 J2.27 | J2.23 51.31,81.03 52.83,81.03 J2.21 53.85,81.03 55.37,81.03 J2.19 | J2.15 60.45,81.03 58.93,81.03 J2.17 | J1.39 30.99,40.39 32.51,40.39 J1.37 33.53,40.39 35.05,40.39 J1.35 36.07,40.39 37.59,40.39 J1.33 38.61,40.39 40.13,40.39 J1.31 41.15,40.39 42.67,40.39 J1.29 | J1.25 47.75,40.39 46.23,40.39 J1.27 | J1.19 55.37,40.39 53.85,40.39 J1.21 | 100.33,25.65 100.33,32.51 101.35,33.53 C35.2 101.85,35.05 102.87,36.07 102.87,52.83 101.85,53.85 C34.2 | 100.33,25.65 100.33,17.02 101.35,16 C36.2 | E35.8 121.67,31.75 120.65,30.73 120.65,16.26 121.67,15.24 E36.8 | J4.8 122.17,72.39 123.19,71.37 123.19,56.9 122.17,55.88 122.17,54.61 E34.8
  Top 0.508: v153.16,54.36 153.16,69.34 150.11,72.39 J3.8 | 100.33,25.65 79.25,25.65 67.31,37.59 67.31,39.12 66.29,40.13 J1.11 | E32.7 147.57,34.29 148.84,35.56 148.84,49.02 149.86,50.04 E31.8 | C23.2 210.57,14.73 209.55,15.75 209.55,35.81 209.68,35.94
  Bottom 0.508: C5.2 339.6,54.36 335.79,54.36 E9.10 334.77,54.36 334.01,55.12 319.28,55.12 318.77,54.61 318.77,51.56 311.66,51.56 308.86,54.36 | E11.10 335.79,13.72 339.6,13.72 C7.2 | E10.10 335.79,34.04 339.6,34.04 C6.2 | E8.7 328.17,74.68 339.6,74.68 C4.2 340.87,75.44 359.41,75.44 360.17,74.68 E4.8 | E5.8 361.19,54.36 367.54,54.36 C1.2 369.06,54.86 369.32,55.12 374.65,55.12 375.41,54.36 E1.3 | 384.81,51.56 385.57,52.32 E1.7 | 384.81,51.56 382.27,51.56 381.51,52.32 E1.5 | E7.8 361.19,13.72 367.54,13.72 C3.2 369.06,14.22 369.32,14.48 374.65,14.48 375.41,13.72 E3.3 | E3.7 385.57,11.68 384.81,10.92 382.27,10.92 381.51,11.68 E3.5 | E2.5 381.51,32 382.27,31.24 384.81,31.24 385.57,32 E2.7 385.83,34.29 384.81,34.29 384.81,51.56 | C2.2 369.06,34.54 369.32,34.8 374.65,34.8 375.41,34.04 E2.3 | R17.1 304.29,30.23 303.28,29.21 301.24,29.21 300.23,30.23 R18.1 | C11.2 309.12,13.72 306.07,13.72 305.31,12.95 R21.1 304.29,12.45 303.28,11.43 301.24,11.43 300.23,12.45 R22.1 299.21,12.95 298.2,13.97 E15.8 | 288.16,54.48 289.05,53.59 R1.1 | 288.16,54.48 288.04,54.61 282.7,54.61 282.45,54.36 E13.8 | 293.24,54.48 293.12,54.61 288.29,54.61 288.16,54.48 | 293.24,54.48 294.13,53.59 R2.1 | 293.24,54.48 293.37,54.61 298.2,54.61 299.21,53.59 R4.1 300.23,53.59 301.24,54.61 303.28,54.61 304.29,53.59 R3.1 305.31,53.59 306.07,54.36 308.86,54.36 | 308.86,54.36 309.12,54.36 C9.2 | E17.8 254.51,54.36 260.86,54.36 C13.2 | E12.8 281.43,73.41 279.91,74.93 262.89,74.93 C12.2 260.86,73.41 251.97,73.41 E16.7 250.95,74.68 250.19,75.44 234.7,75.44 234.44,75.18 C16.2 | E19.8 254.51,13.72 255.78,14.99 260.86,14.99 C15.2
  Bottom 0.508: C14.2 260.86,34.04 254.51,34.04 E18.8 253.49,32 252.73,31.24 237.49,31.24 236.73,32 E18.1 235.71,34.04 234.44,34.04 C18.2 232.92,34.04 229.11,34.04 E22.7 | v236.73,37.59 238.51,39.37 E18.15 | v236.73,17.53 236.98,17.53 238.51,19.05 E19.15 | E30.7 175.77,14.99 184.66,14.99 C26.2 185.93,15.75 197.1,15.75 v197.61,16.26 197.87,16 208.28,16 210.06,14.22 C23.2 211.33,14.48 227.33,14.48 228.09,13.72 E23.7 | E28.8 178.31,54.36 184.66,54.36 C24.2 | v185.42,50.55 185.67,50.8 202.95,50.8 v203.2,50.55 | E17.1 235.71,54.36 234.44,54.36 C17.2 232.92,54.36 229.11,54.36 E21.7 228.09,54.36 227.33,55.12 211.84,55.12 211.58,54.86 C21.2 210.06,54.86 207.01,54.86 v205.74,56.13 | C22.2 210.06,34.04 203.71,34.04 E25.7 202.69,34.04 201.93,34.8 195.33,34.8 | E32.7 147.83,34.04 156.72,34.04 C29.2 157.99,34.8 176.53,34.8 177.29,34.04 E29.8 178.31,34.04 184.66,34.04 C25.2 185.93,34.8 192.79,34.8 | 195.33,34.8 192.79,34.8 | J2.27 46.23,81.03 47.75,81.03 J2.25 48.77,81.03 50.29,81.03 J2.23 | J2.17 57.91,81.03 56.39,81.03 J2.19 | C39.- 16.26,81.79 17.27,82.8 28.7,82.8 29.97,81.53 J2.39 | 6.86,24.13 5.84,23.11 R27.1 | 6.86,24.13 10.92,24.13 11.94,25.15 R30.1 | 6.86,24.13 6.86,38.86 GND.1 9.4,41.4 10.16,42.16 28.7,42.16 29.97,40.89 J1.39 | J1.27 45.21,40.39 43.69,40.39 J1.29 | J1.25 48.77,40.39 50.29,40.39 J1.23 51.31,40.39 52.83,40.39 J1.21 | J1.19 56.39,40.39 57.91,40.39 J1.17 58.93,40.39 60.45,40.39 J1.15 61.47,40.39 62.99,40.39 J1.13 64.01,40.39 65.53,40.39 J1.11 | E35.8 122.43,34.04 128.78,34.04 C32.2 | C33.2 128.78,13.72 122.43,13.72 E36.8 121.41,14.99 120.65,15.75 102.11,15.75 C36.2
  Bottom 0.508: J3.8 150.37,73.41 156.72,73.41 C27.2 157.99,74.17 173.99,74.17 174.75,73.41 E27.7 | C28.2 156.72,54.36 v153.16,54.36 150.37,54.36 E31.8 149.35,54.36 148.59,55.12 130.05,55.12 C31.2 128.78,54.36 122.43,54.36 E34.8 121.41,54.36 119.89,55.88 103.38,55.88 102.36,54.86 C34.2 | 192.79,34.8 192.79,34.29 E25.3 | 195.33,34.8 195.33,34.29 E25.4
  pour Top (isolate 0.254): 0,0 0,93.98 393.7,93.98 393.7,0
KEYSTB  (via drill 0.61)
  Top 0.254: v191.26,55.37 191.52,55.63 191.52,75.18 v191.01,75.69
  Bottom 0.254: v191.26,55.37 189.48,55.37 188.47,54.36 E24.1 | J4.2 107.19,74.68 108.71,76.2 190.5,76.2 v191.01,75.69 191.26,75.95 192.02,75.95 192.28,76.2 293.88,76.2 298.2,71.88 321.31,71.88 322.07,72.64 E8.5
LDSR  (via drill 0.61)
  Top 0.254: E7.9 360.43,21.59 359.66,22.35 359.66,38.61 360.43,39.37 E6.9 360.93,41.91 361.7,42.67 361.7,62.99 | v193.55,89.92 187.96,84.33 187.96,77.72 175.26,77.72 173.74,79.25 173.74,82.04 171.96,83.82 171.96,91.19 154.69,91.19 148.84,85.34 148.84,79.5 140.72,79.5 136.14,74.93 136.14,58.42 135.64,57.91 135.64,22.35 134.87,21.59 E33.13 | v360.43,76.2 361.7,74.93 361.7,62.99 | 361.7,62.99 360.93,62.23 E5.9
  Bottom 0.254: v193.55,89.92 194.56,90.93 264.41,90.93 272.03,83.31 277.11,83.31 277.88,84.07 334.52,84.07 342.39,76.2 v360.43,76.2
MH0  (via drill 0.61)
  Top 0.254: 222.5,76.71 225.81,80.01 E20.9 | 222.5,76.71 222,76.2 222,42.67 221.23,41.91 E22.11 | v268.48,77.98 267.72,78.74 267.72,83.82 261.62,89.92 222.5,89.92 222.5,76.71
  Bottom 0.254: v268.48,77.98 312.17,77.98 314.45,80.26 E8.13
MPXA  (via drill 0.61)
  Top 0.254: 240.28,22.35 241.05,21.59 E19.14 | 240.28,22.35 240.28,38.61 | 240.28,38.61 241.05,39.37 E18.14 | 240.28,38.61 240.28,58.93 241.05,59.69 E17.14 | v100.58,77.72 99.57,76.71 99.57,26.92 v99.31,26.67 | v121.92,26.16 123.7,24.38 123.7,11.94 v131.83,3.81 | v134.62,3.81 135.13,3.3 172.97,3.3 v172.97,5.33 | v171.7,6.6 171.45,6.86 171.45,16.76 171.7,17.02 171.7,23.37 v172.21,23.88 | v191.52,23.37 193.04,24.89 v193.04,26.67 | v223.52,24.64 225.04,23.11 225.04,10.16 225.81,9.4 240.28,9.4 240.28,22.35
  Bottom 0.254: v100.58,77.72 106.17,77.72 108.71,80.26 J4.14 | v99.31,26.67 99.82,26.16 v121.92,26.16 | v134.62,3.81 v131.83,3.81 | v171.7,6.6 v172.97,5.33 | v172.21,23.88 172.72,23.37 v191.52,23.37 | v193.04,26.67 195.33,28.96 205.74,28.96 206.5,28.19 207.26,28.19 207.52,28.45 214.38,28.45 218.19,24.64 v223.52,24.64
MPXB  (via drill 0.61)
  Top 0.254: 237.74,30.99 237.74,14.73 238.51,13.97 E19.2 | 237.74,30.99 238.51,31.75 E18.2 | 237.74,30.99 237.74,51.31 238.51,52.07 E17.2 239.01,54.61 239.78,55.37 v239.78,86.11 | v118.11,88.14 112.27,82.3 J4.13 | v178.82,84.33 179.32,83.82 v179.32,79.25 | v200.41,79.25 v207.26,86.11
  Bottom 0.254: v118.11,88.14 118.62,88.65 145.54,88.65 146.56,89.66 161.29,89.66 162.31,88.65 174.24,88.65 178.56,84.33 v178.82,84.33 | v179.32,79.25 179.83,79.76 199.9,79.76 v200.41,79.25 | v207.26,86.11 v239.78,86.11
N$1
  Top 0.254: E10.6 325.37,31.75 326.64,30.48 326.64,28.7 334.26,21.08 334.26,18.29 341.63,10.92 349,10.92 349,35.56 352.81,39.37 E6.12